# Altium schematic sheet Top.SchDoc: Top Schematic
size A4; Date: Not used; ApprovedBy: Not used; CheckedBy: Not used; Author: Not used; CompanyName: STMicroelectronics; DrawnBy: Not used; Engineer: Not used; Organization: Not used; Address1: Not used; Address2: Not used; Address3: Not used; Address4: Not used; DocumentNumber: Not used; Revision: Not used; SheetNumber: 2; SheetTotal: 6; CurrentTime: Not used; CurrentDate: Not used; Time: Not used; DocumentFullPathAndName: Not used; DocumentName: Not used; ModifiedDate: Not used; ImagePath: Not used; ProjectName: Not used; Application_BuildNumber: Not used
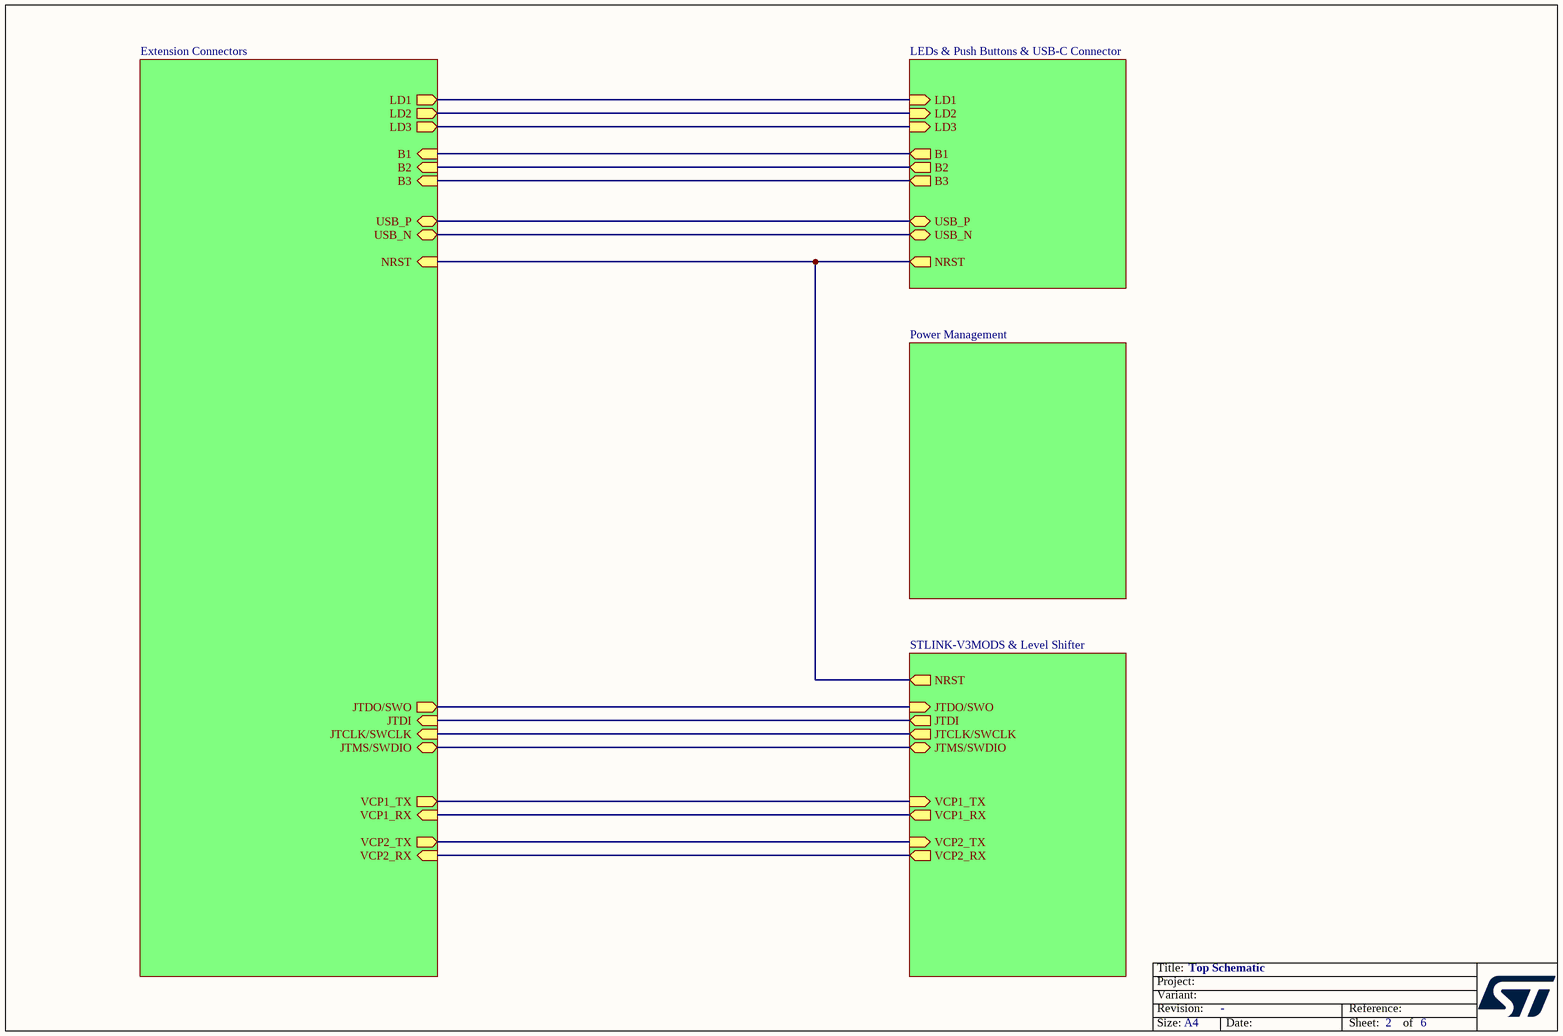
[diagram p0: Top.SchDoc]

## Sub-sheets
Extension Connectors = Extension_CN.SchDoc: VCP1_TX (out), VCP1_RX (in), VCP2_TX (out), VCP2_RX (in), JTDO/SWO (out), JTDI (in), JTCLK/SWCLK (in), JTMS/SWDIO (bidir), LD1 (out), LD2 (out), LD3 (out), B1 (in), B2 (in), B3 (in), USB_P (bidir), USB_N (bidir), NRST (in)
LEDs & Push Buttons & USB-C Connector = Accessories.SchDoc: LD1 (in), LD2 (in), LD3 (in), B1 (out), B2 (out), B3 (out), USB_P (bidir), USB_N (bidir), NRST (out)
Power Management = Power_Management.SchDoc: no entries
STLINK-V3MODS & Level Shifter = STlink.SchDoc: VCP1_TX (in), VCP1_RX (out), VCP2_TX (in), VCP2_RX (out), JTDO/SWO (in), JTDI (out), JTCLK/SWCLK (out), JTMS/SWDIO (bidir), NRST (out)

## Nets
(unnamed): sheet Extension Connectors/VCP1_TX, sheet STLINK-V3MODS & Level Shifter/VCP1_TX
(unnamed): sheet Extension Connectors/VCP1_RX, sheet STLINK-V3MODS & Level Shifter/VCP1_RX
(unnamed): sheet Extension Connectors/VCP2_TX, sheet STLINK-V3MODS & Level Shifter/VCP2_TX
(unnamed): sheet Extension Connectors/VCP2_RX, sheet STLINK-V3MODS & Level Shifter/VCP2_RX
(unnamed): sheet Extension Connectors/JTDO/SWO, sheet STLINK-V3MODS & Level Shifter/JTDO/SWO
(unnamed): sheet Extension Connectors/JTDI, sheet STLINK-V3MODS & Level Shifter/JTDI
(unnamed): sheet Extension Connectors/JTCLK/SWCLK, sheet STLINK-V3MODS & Level Shifter/JTCLK/SWCLK
(unnamed): sheet Extension Connectors/JTMS/SWDIO, sheet STLINK-V3MODS & Level Shifter/JTMS/SWDIO
(unnamed): sheet Extension Connectors/LD1, sheet LEDs & Push Buttons & USB-C Connector/LD1
(unnamed): sheet Extension Connectors/LD2, sheet LEDs & Push Buttons & USB-C Connector/LD2
(unnamed): sheet Extension Connectors/LD3, sheet LEDs & Push Buttons & USB-C Connector/LD3
(unnamed): sheet Extension Connectors/B1, sheet LEDs & Push Buttons & USB-C Connector/B1
(unnamed): sheet Extension Connectors/B2, sheet LEDs & Push Buttons & USB-C Connector/B2
(unnamed): sheet Extension Connectors/B3, sheet LEDs & Push Buttons & USB-C Connector/B3
(unnamed): sheet Extension Connectors/USB_P, sheet LEDs & Push Buttons & USB-C Connector/USB_P
(unnamed): sheet Extension Connectors/USB_N, sheet LEDs & Push Buttons & USB-C Connector/USB_N
(unnamed): sheet Extension Connectors/NRST, sheet LEDs & Push Buttons & USB-C Connector/NRST, sheet STLINK-V3MODS & Level Shifter/NRST

## Notes on the sheet
- Title:
- Project:
- Size:
- Revision:
- Variant:
- A4
- -
- Date:
- Reference:
- Sheet:
- of